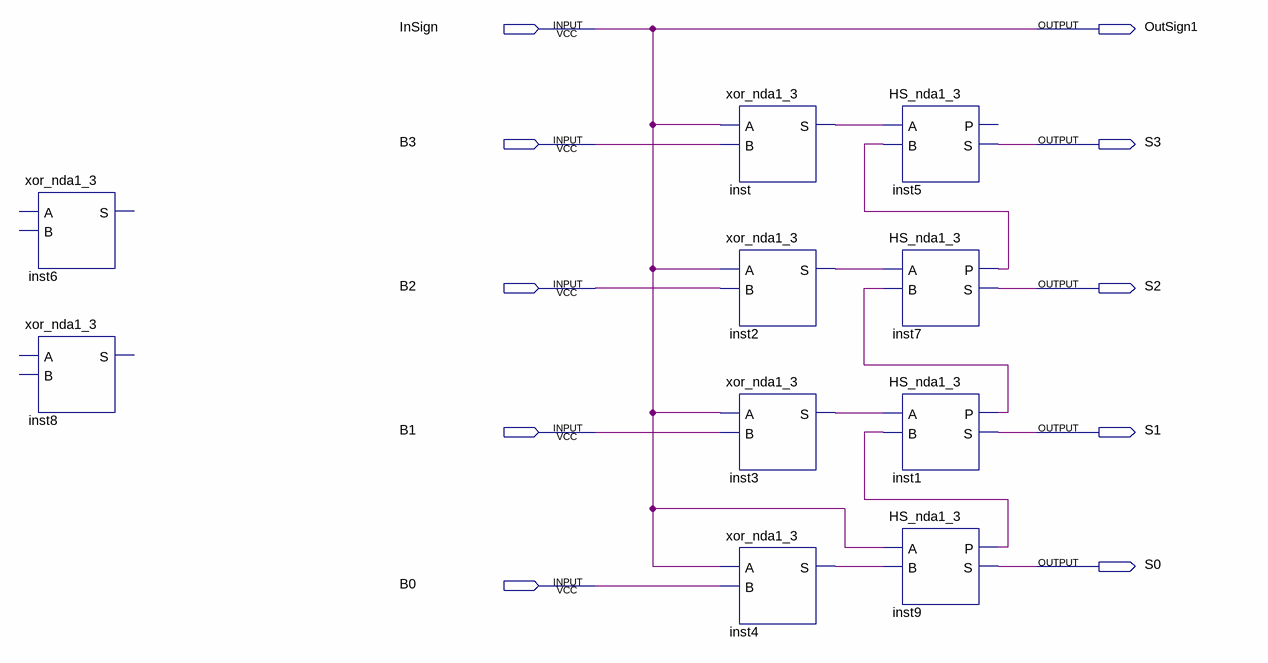
[diagram p0: schematic sheet]
// Quartus schematic straight_addition_code_nda3_2.bdf as structural Verilog: 10 symbols, 10 pins
module straight_addition_code_nda3_2 (
  input  InSign,
  input  B3,
  input  B2,
  input  B1,
  input  B0,
  output OutSign1,
  output S3,
  output S2,
  output S1,
  output S0
);

  wire inst1_p, inst2_s, inst3_s, inst4_s, inst7_p, inst9_p, inst_s;

  xor_nda1_3 inst6 ();  // open: A, B, S
  xor_nda1_3 inst8 ();  // open: A, B, S
  xor_nda1_3 inst (.A(InSign), .B(B3), .S(inst_s));
  xor_nda1_3 inst2 (.A(InSign), .B(B2), .S(inst2_s));
  xor_nda1_3 inst3 (.A(InSign), .B(B1), .S(inst3_s));
  xor_nda1_3 inst4 (.A(InSign), .B(B0), .S(inst4_s));
  HS_nda1_3 inst5 (.A(inst_s), .B(inst7_p), .S(S3));  // open: P
  HS_nda1_3 inst7 (.A(inst2_s), .B(inst1_p), .P(inst7_p), .S(S2));
  HS_nda1_3 inst1 (.A(inst3_s), .B(inst9_p), .P(inst1_p), .S(S1));
  HS_nda1_3 inst9 (.A(InSign), .B(inst4_s), .P(inst9_p), .S(S0));

  assign OutSign1 = InSign;
endmodule
